# EAGLE design CHR_ver1 (EAGLE 9.6.2)

## Sheet 1 of 3
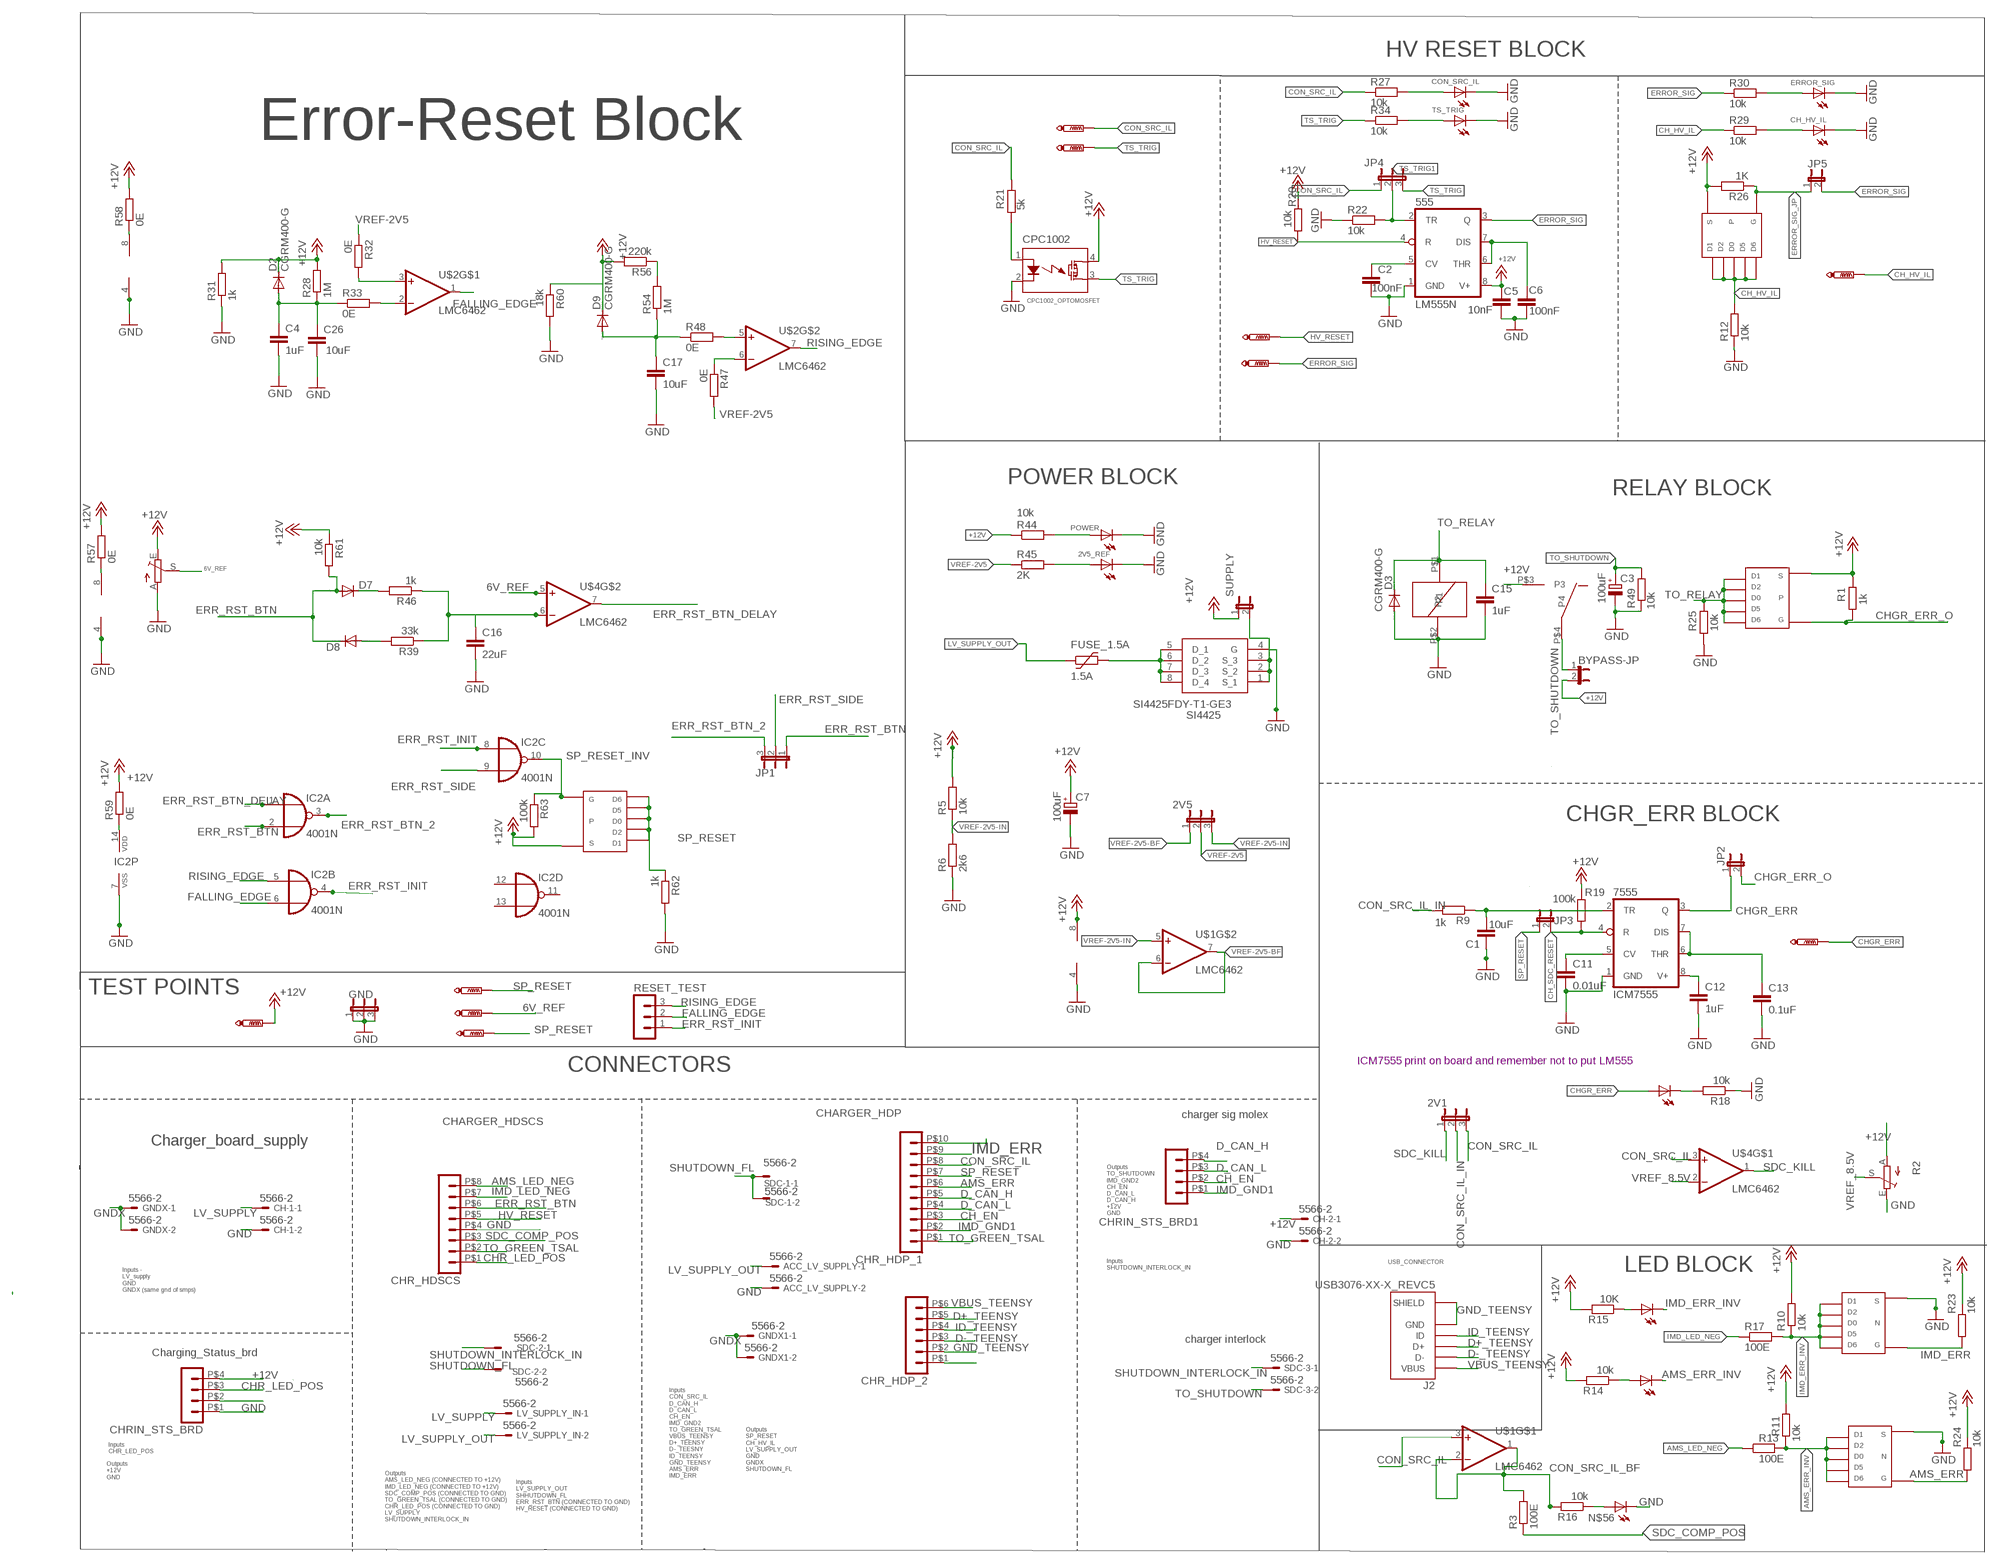
[diagram p0: schematic, sheet 1]

### Parts
2V1  JP2E  [JP2]
2V5  JP2E  [JP2]
2V5_REF  LED-FKIT-1206  [FKIT-LED-1206]
555  LM555N  [DIL08]
7555  ICM7555  LM555N  [DIL08]
+12V  PTR1PAD1-13  [P1-13]
ACC_LV_SUPPLY  5566-2  [5566-2]
AMS  LED-FKIT-1206  [FKIT-LED-1206]
AMS1  LED-FKIT-1206  [FKIT-LED-1206]
BYPASS-JP  JP1E  [JP1]
C1  10uF  C-EUC0805  [C0805]
C2  100nF  C-EUC0805  [C0805]
C3  100uF  CPOL-EUE2.5-6  [E2,5-6]
C4  1uF  C-EUC0805  [C0805]
C5  10nF  C-EUC0805  [C0805]
C6  100nF  C-EUC0805  [C0805]
C7  100uF  CPOL-EUE2.5-6  [E2,5-6]
C11  0.01uF  C-EUC0805  [C0805]
C12  1uF  C-EUC0805  [C0805]
C13  0.1uF  C-EUC0805  [C0805]
C15  1uF  C-EUC0805  [C0805]
C16  22uF  C-EUC0805  [C0805]
C17  10uF  C-EUC0805  [C0805]
C26  10uF  C-EUC0805  [C0805]
CH-1  5566-2  [5566-2]
CH-2  5566-2  [5566-2]
CH-HV-IL  PTR1PAD1-13  [P1-13]
CH_HV_IL  LED-FKIT-1206  [FKIT-LED-1206]
CHGR-ERR  PTR1PAD1-13  [P1-13]
CHGR_ERR  LED-FKIT-1206  [FKIT-LED-1206]
CHR_HDP_1  HEADER_POS10_44914-1001  [44914-1001]
CHR_HDP_2  HEADER_POS6_44914-0601  [44914-0601]
CHR_HDSCS  HEADER_POS8_44914-0801  [44914-0801]
CHRIN_STS_BRD  HEADER_POS4_44914-0401  [44914-0401]
CHRIN_STS_BRD1  HEADER_POS4_44914-0401  [44914-0401]
CON-SRC-IL  PTR1PAD1-13  [P1-13]
CON_SRC_IL  LED-FKIT-1206  [FKIT-LED-1206]
CPC1002  CPC1002_OPTOMOSFET  [SOP04]
D2  CGRM400-G  [SOD-123_MINI-SMA]
D3  CGRM400-G  [SOD-123_MINI-SMA]
D7  DIODE-DO214AC  [DO214AC]
D8  DIODE-DO214AC  [DO214AC]
D9  CGRM400-G  [SOD-123_MINI-SMA]
ERROR-SIG  PTR1PAD1-13  [P1-13]
ERROR_SIG  LED-FKIT-1206  [FKIT-LED-1206]
FUSE_1.5A  1.5A  1206L  [1206L]
GND  JP2E  [JP2]
GNDX  5566-2  [5566-2]
GNDX1  5566-2  [5566-2]
HV-RESET  PTR1PAD1-13  [P1-13]
IC2  4001N  [DIL14]
IMD  LED-FKIT-1206  [FKIT-LED-1206]
J2  USB3076-XX-X_REVC5  [GCT_USB3076-XX-X_REVC5]
JP1  JP2E  [JP2]
JP2  JP1E  [JP1]
JP3  JP1E  [JP1]
JP4  JP2E  [JP2]
JP5  JP1E  [JP1]
LV_SUPPLY_IN  5566-2  [5566-2]
POWER  LED-FKIT-1206  [FKIT-LED-1206]
R1  1k  R-EU_R0805  [R0805]
R2  TRIM_EU-S63S  [S63S]
R3  100E  R-EU_M0805  [M0805]
R5  10k  R-EU_R0805  [R0805]
R6  2k6  R-EU_R0805  [R0805]
R9  1k  R-EU_R0805  [R0805]
R10  10k  R-EU_R0805  [R0805]
R11  10k  R-EU_R0805  [R0805]
R12  10k  R-EU_R0805  [R0805]
R13  100E  R-EU_M0805  [M0805]
R14  10k  R-EU_M0805  [M0805]
R15  10K  R-EU_M0805  [M0805]
R16  10k  R-EU_M0805  [M0805]
R17  100E  R-EU_M0805  [M0805]
R18  10k  R-EU_R0805  [R0805]
R19  100k  R-EU_R0805  [R0805]
R20  10k  R-EU_R0805  [R0805]
R21  5k  R-EU_R0805  [R0805]
R22  10k  R-EU_R0805  [R0805]
R23  10k  R-EU_R0805  [R0805]
R24  10k  R-EU_R0805  [R0805]
R25  10k  R-EU_R0805  [R0805]
R26  1K  R-EU_R0805  [R0805]
R27  10k  R-EU_R0805  [R0805]
R28  1M  R-EU_R0805  [R0805]
R29  10k  R-EU_R0805  [R0805]
R30  10k  R-EU_R0805  [R0805]
R31  1k  R-EU_R0805  [R0805]
R32  0E  R-EU_R0805  [R0805]
R33  0E  R-EU_R0805  [R0805]
R34  10k  R-EU_R0805  [R0805]
R39  33k  R-EU_R0805  [R0805]
R44  10k  R-EU_R0805  [R0805]
R45  2K  R-EU_R0805  [R0805]
R46  1k  R-EU_R0805  [R0805]
R47  0E  R-EU_R0805  [R0805]
R48  0E  R-EU_R0805  [R0805]
R49  10k  R-EU_R0805  [R0805]
R54  1M  R-EU_R0805  [R0805]
R56  220k  R-EU_R0805  [R0805]
R57  0E  R-EU_R0805  [R0805]
R58  0E  R-EU_R0805  [R0805]
R59  0E  R-EU_R0805  [R0805]
R60  18k  R-EU_R0805  [R0805]
R61  10k  R-EU_R0805  [R0805]
R62  1k  R-EU_R0805  [R0805]
R63  100k  R-EU_R0805  [R0805]
REF_POT1  10k  TRIM_EU-S63S  [S63S]
RESET_TEST  MA03-1  [MA03-1]
SDC-1  5566-2  [5566-2]
SDC-2  5566-2  [5566-2]
SDC-3  5566-2  [5566-2]
SI4425  SI4425FDY-T1-GE3  [SOIC127P600X175-8N]
SP_RESET  PTR1PAD1-13  [P1-13]
SP_RESET1  PTR1PAD1-13  [P1-13]
SP_RESET2  PTR1PAD1-13  [P1-13]
SUPPLY  JP1E  [JP1]
TS-TRIG  PTR1PAD1-13  [P1-13]
TS_TRIG  LED-FKIT-1206  [FKIT-LED-1206]
U$1  LMC6462  [S08]
U$2  LMC6462  [S08]
U$3  TSOP-6_PMOS  [TSOP-6_PMOS]
U$4  LMC6462  [S08]
U$5  TSOP-6_NMOS  [TSOP-6_NMOS]
U$7  TSOP-6_NMOS  [TSOP-6_NMOS]
U$8  TSOP-6_PMOS  [TSOP-6_PMOS]
U$9  G6DN_RELAY  [G6DN_RELAY]
U$11  TSOP-6_PMOS  [TSOP-6_PMOS]

### Nets
6V_REF: REF_POT1.S SP_RESET1.TP U$4.5(+IN)
+12V: 555.8(V+) 7555.8(V+) +12V.TP BYPASS-JP.2 C5.1 C7.+ C12.1 CH-2.1 CHRIN_STS_BRD.P$4 CPC1002.4 D2.C D9.C R1.2 R2.A R5.2 R10.2 R11.2 R14.2 R15.2 R19.1 R20.2 R23.2 R24.2 R26.2 R28.2 R31.2 R44.1 R56.2 R57.2 R58.2 R59.2 R60.1 R61.1 R63.2 REF_POT1.E SUPPLY.1 U$1.8(V+) U$3.S U$8.S U$9.P$3(P3) U$11.S
AMS_ERR: CHR_HDP_1.P$6 R24.1 U$5.G
AMS_ERR_INV: AMS.C R11.1 R13.2 U$5.1 U$5.2 U$5.5 U$5.6 U$5.D(D0)
AMS_LED_NEG: CHR_HDSCS.P$8 R13.1
CH_EN: CHR_HDP_1.P$3 CHRIN_STS_BRD1.P$2
CH_HV_IL: CH-HV-IL.TP CHR_HDP_1.P$10 R12.2 R29.1 U$8.1 U$8.2 U$8.5 U$8.6 U$8.D(D0)
CH_SDC_RESET: 7555.4(R) JP3.2 R19.2
CHGR_ERR: 7555.3(Q) CHGR-ERR.TP CHGR_ERR.A JP2.1
CHGR_ERR_O: JP2.2 R1.1 U$3.G
CHR_LED_POS: CHR_HDSCS.P$1 CHRIN_STS_BRD.P$3
CON_SRC_IL: 2V1.3 CHR_HDP_1.P$8 CON-SRC-IL.TP JP4.1 R21.2 R27.1 U$1.3(+IN) U$4.3(+IN)
CON_SRC_IL_BF: R3.2 R16.2 U$1.1(OUT) U$1.2(-IN)
CON_SRC_IL_IN: 2V1.2 R9.2
D+_TEENSY: CHR_HDP_2.P$5 J2.3(D+)
D-_TEENSY: CHR_HDP_2.P$3 J2.2(D-)
D_CAN_H: CHR_HDP_1.P$5 CHRIN_STS_BRD1.P$4
D_CAN_L: CHR_HDP_1.P$4 CHRIN_STS_BRD1.P$3
ERR_RST_BTN: CHR_HDSCS.P$6 D7.A D8.C IC2.2(A:I1) JP1.1 R61.2
ERR_RST_BTN_2: IC2.3(A:O) JP1.3
ERR_RST_BTN_DELAY: IC2.1(A:I0) U$4.7(OUT)
ERR_RST_INIT: IC2.4(B:O) IC2.8(C:I0) RESET_TEST.1
ERR_RST_SIDE: IC2.9(C:I1) JP1.2
ERROR_SIG: 555.3(Q) ERROR-SIG.TP JP5.2 R30.1
ERROR_SIG_JP: JP5.1 R26.1 U$8.G
FALLING_EDGE: IC2.6(B:I1) RESET_TEST.2 U$2.1(OUT)
GND: 2V5_REF.C 555.1(GND) 7555.1(GND) ACC_LV_SUPPLY.2 AMS1.C C1.1 C2.2 C3.- C4.2 C5.2 C6.2 C7.- C11.2 C12.2 C13.2 C15.2 C16.2 C17.2 C26.2 CH-1.2 CH-2.2 CH_HV_IL.C CHR_HDSCS.P$4 CHRIN_STS_BRD.P$1 CON_SRC_IL.C CPC1002.2 D3.A ERROR_SIG.C GND.1 GND.2 GND.3 IC2.7(P:VSS) POWER.C R2.E R6.1 R12.1 R18.1 R22.1 R25.1 R31.1 R49.1 R60.2 R62.2 REF_POT1.A SI4425.4(G) TS_TRIG.C U$1.4(V-) U$2.4(V-) U$4.4(V-) U$5.S U$7.S U$9.P$2(P2)
GND_TEENSY: CHR_HDP_2.P$2 J2.5(GND) J2.6(SHIELD) J2.7(SHIELD) J2.8(SHIELD) J2.9(SHIELD) J2.10(SHIELD) J2.11(SHIELD)
GNDX: GNDX1.1 GNDX1.2 GNDX.1 GNDX.2
HV_RESET: 555.4(R) CHR_HDSCS.P$5 HV-RESET.TP R20.1
ID_TEENSY: CHR_HDP_2.P$4 J2.4(ID)
IMD_ERR: CHR_HDP_1.P$9 R23.1 U$7.G
IMD_ERR_INV: IMD.C R10.1 R17.2 U$7.1 U$7.2 U$7.5 U$7.6 U$7.D(D0)
IMD_GND1: CHR_HDP_1.P$2 CHRIN_STS_BRD1.P$1
IMD_LED_NEG: CHR_HDSCS.P$7 R17.1
LV_SUPPLY: CH-1.1 LV_SUPPLY_IN.1
LV_SUPPLY_OUT: ACC_LV_SUPPLY.1 FUSE_1.5A.P$1 LV_SUPPLY_IN.2
N$1: 7555.2(TR) C1.2 R9.1
N$3: 555.5(CV) C2.1
N$4: CHGR_ERR.C R18.2
N$7: 555.6(THR) 555.7(DIS) C6.1
N$9: CPC1002.1 R21.1
N$10: CON_SRC_IL.A R27.2
N$11: CH_HV_IL.A R29.2
N$13: ERROR_SIG.A R30.2
N$14: R34.2 TS_TRIG.A
N$16: 7555.5(CV) C11.1
N$18: 7555.6(THR) 7555.7(DIS) C13.1
N$21: SI4425.1(S_1) SI4425.2(S_2) SI4425.3(S_3) SUPPLY.2
N$23: FUSE_1.5A.P$2 SI4425.5(D_1) SI4425.6(D_2) SI4425.7(D_3) SI4425.8(D_4)
N$24: POWER.A R44.2
N$26: 2V5_REF.A R45.2
N$33: CHR_HDP_2.P$1
N$35: AMS.A R14.1
N$37: IMD.A R15.1
N$38: C4.1 C26.1 D2.A R28.1 R33.1
N$39: CHRIN_STS_BRD.P$2
N$40: R32.2 U$2.3(+IN)
N$41: R33.2 U$2.2(-IN)
N$42: D8.A R39.2
N$43: D7.C R46.2
N$44: C16.1 R39.1 R46.1 U$4.6(-IN)
N$45: R47.1 U$2.6(-IN)
N$46: C17.1 D9.A R48.1 R54.1
N$47: R48.2 U$2.5(+IN)
N$48: R54.2 R56.1
N$49: R58.1 U$2.8(V+)
N$50: R57.1 U$4.8(V+)
N$51: IC2.14(P:VDD) R59.1
N$56: AMS1.A R16.1
RISING_EDGE: IC2.5(B:I0) RESET_TEST.3 U$2.7(OUT)
SDC_COMP_POS: CHR_HDSCS.P$3 R3.1
SDC_KILL: 2V1.1 U$4.1(OUT)
SHUTDOWN_FL: SDC-1.1 SDC-1.2 SDC-2.2
SHUTDOWN_INTERLOCK_IN: SDC-2.1 SDC-3.1
SP_RESET: CHR_HDP_1.P$7 JP3.1 R62.1 SP_RESET2.TP SP_RESET.TP U$11.1 U$11.2 U$11.5 U$11.6 U$11.D(D0)
SP_RESET_INV: IC2.10(C:O) R63.1 U$11.G
TO_GREEN_TSAL: CHR_HDP_1.P$1 CHR_HDSCS.P$2
TO_RELAY: C15.1 D3.C R25.2 U$3.1 U$3.2 U$3.5 U$3.6 U$3.D(D0) U$9.P$1(P1)
TO_SHUTDOWN: BYPASS-JP.1 C3.+ R49.2 SDC-3.2 U$9.P$4(P4)
TS_TRIG: CPC1002.3 JP4.3 R34.1 TS-TRIG.TP
TS_TRIG1: 555.2(TR) JP4.2 R22.2
VBUS_TEENSY: CHR_HDP_2.P$6 J2.1(VBUS)
VREF-2V5: 2V5.2 R32.1 R45.1 R47.2
VREF-2V5-BF: 2V5.1 U$1.6(-IN) U$1.7(OUT)
VREF-2V5-IN: 2V5.3 R5.1 R6.2 U$1.5(+IN)
VREF_8.5V: R2.S U$4.2(-IN)
Unconnected: IC2.11(D:O) IC2.12(D:I0) IC2.13(D:I1)

### Notes on the sheet
- HV RESET BLOCK
- Error-Reset Block
- POWER BLOCK
- RELAY BLOCK
- CHGR_ERR BLOCK
- TEST POINTS
- ICM7555 print on board and remember not to put LM555
- CONNECTORS
- CHARGER_HDP | charger sig molex
- CHARGER_HDSCS
- Charger_board_supply
- Outputs
  TO_SHUTDOWN
  IMD_GND2
  CH_EN
  D_CAN_L
  D_CAN_H
  +12V
  GND
- USB_CONNECTOR
- Inputs
  SHUTDOWN_INTERLOCK_IN
- LED BLOCK
- Inputs -
  LV_supply
  GND
  GNDX (same gnd of smps)
- charger interlock
- Charging_Status_brd
- Inputs
  CHR_LED_POS
- Inputs
  CON_SRC_IL
  D_CAN_H
  D_CAN_L
  CH_EN
  IMD_GND2
  TO_GREEN_TSAL
  VBUS_TEENSY
  D+_TEENSY
  D-_TEESNY
  ID_TEENSY
  GND_TEENSY
  AMS_ERR
  IMD_ERR
- Outputs
  SP_RESET
  CH_HV_IL
  LV_SUPPLY_OUT
  GND
  GNDX
  SHUTDOWN_FL
- Outputs
  +12V
  GND
- Inputs
  LV_SUPPLY_OUT
  SHHUTDOWN_FL
  ERR_RST_BTN (CONNECTED TO GND)
  HV_RESET (CONNECTED TO GND)
- Outputs
  AMS_LED_NEG (CONNECTED TO +12V)
  IMD_LED_NEG (CONNECTED TO +12V)
  SDC_COMP_POS (CONNECTED TO GND)
  TO_GREEN_TSAL (CONNECTED TO GND)
  CHR_LED_POS (CONNECTED TO GND)
  LV_SUPPLY
  SHUTDOWN_INTERLOCK_IN

## Sheet 2 of 3

## Sheet 3 of 3

## Library data of the parts
2V1 2V5 GND JP1 JP4 = jumper:JP2E: JUMPER
2V5_REF AMS AMS1 CH_HV_IL CHGR_ERR CON_SRC_IL ERROR_SIG IMD POWER TS_TRIG = IIT_BOMBAY_Racing:LED: LEDs Standard schematic elements and footprints for 5mm, 3mm, 1206, and 0603 sized LEDs. 5mm - Spark Fun Electronics SKU : COM-00529 (and others)
555 7555 = linear:*555: TIMER
+12V CH-HV-IL CHGR-ERR CON-SRC-IL ERROR-SIG HV-RESET SP_RESET SP_RESET1 SP_RESET2 TS-TRIG = testpad:PTR1: TEST PIN
ACC_LV_SUPPLY CH-1 CH-2 GNDX GNDX1 LV_SUPPLY_IN SDC-1-SDC-3 = con-molex:5566-2: Mini FIT connector 2 pol Source: http://www.molex.com; MF: MOLEX; OC_FARNELL: 1822072; OC_NEWARK: unknown
BYPASS-JP JP2 JP3 JP5 SUPPLY = jumper:JP1E: JUMPER
C1 C2 C4-C6 C11-C13 C15-C17 C26 = IIT_BOMBAY_Racing:C-EU: CAPACITOR, European symbol
C3 C7 = IIT_BOMBAY_Racing:CPOL-EU: POLARIZED CAPACITOR, European symbol
CHR_HDP_1 = IIT_BOMBAY_Racing:HEADER_POS10_?: Molex - Micro-Fit 3.0 Series connector, 3.00mm (0.118") pitch header, 10 positions.
CHR_HDP_2 = IIT_BOMBAY_Racing:HEADER_POS6_?: Molex - Micro-Fit 3.0 Series connector, 3.00mm (0.118") pitch header, 6 positions.
CHR_HDSCS = IIT_BOMBAY_Racing:HEADER_POS8_?: Molex - Micro-Fit 3.0 Series connector, 3.00mm (0.118") pitch header, 8 positions.
CHRIN_STS_BRD CHRIN_STS_BRD1 = IIT_BOMBAY_Racing:HEADER_POS4_?: Molex - Micro-Fit 3.0 Series connector, 3.00mm (0.118") pitch header, 4 positions.
CPC1002 = IIT_BOMBAY_Racing:CPC1002_OPTOMOSFET: optomosfet for the precharge brd(hv indicator)
D2 D3 D9 = IIT_BOMBAY_Racing:CGRM400*-G: Molded plasitc,JEDEC SOD-123/Mini SMA Source: Comchip CGRM4001-G.pdf
D7 D8 = IIT_BOMBAY_Racing2:DIODE-: DIODE
FUSE_1.5A = fuse_1206L:1206L; MFR: Littelfuse; MFR_ID: 1206L175SLYR; PRODUCT_ID: 576-1206L175SLYR
IC2 = 40xx:4001: Quad 2-input NOR
J2 = USB3076-XX-X_REVC5:USB3076-XX-X_REVC5: Check availability <https://pricing.snapeda.com/parts/USB3076-30-A/Global%20Connector%20Technology/view-part?ref=eda>; AVAILABILITY: Not in stock; CHECK_PRICES: https://www.snapeda.com/parts/USB3076-30-A/Global+Connector+Technology/view-part/?ref=eda; DESCRIPTION: USB - micro B USB 2.0 Receptacle Connector 5 Position Surface Mount, Right Angle; Through Hole, 2.35mm profile, 5 Pins, Horizontal, Bottom mount; MF: Global Connector Technology; MP: USB3076-30-A; PACKAGE: None; PRICE: None; SNAPEDA_LINK: https://www.snapeda.com/parts/USB3076-30-A/Global+Connector+Technology/view-part/?ref=snap
R1 R5 R6 R9-R12 R18-R34 R39 R44-R49 R54 R56-R63 = IIT_BOMBAY_Racing:R-EU_: RESISTOR, European symbol
R2 REF_POT1 = IIT_BOMBAY_Racing:TRIM_EU-: POTENTIOMETER
R3 R13-R17 = rcl:R-EU_: RESISTOR, European symbol; SPICEPREFIX: R
RESET_TEST = con-lstb:MA03-1: PIN HEADER; OC_FARNELL: unknown; OC_NEWARK: unknown
SI4425 = SamacSys_Parts:SI4425FDY-T1-GE3: MOSFET P-CHANNEL 30-V (D-S) MOSFET Source: Datasheet <https://www.vishay.com/docs/77095/si4425fdy.pdf>; DESCRIPTION: MOSFET P-CHANNEL 30-V (D-S) MOSFET; HEIGHT: 1.75mm; MANUFACTURER_NAME: Vishay; MANUFACTURER_PART_NUMBER: SI4425FDY-T1-GE3; MOUSER_PART_NUMBER: 78-SI4425FDY-T1-GE3; MOUSER_PRICE-STOCK: https://www.mouser.co.uk/ProductDetail/Vishay-Siliconix/SI4425FDY-T1-GE3?qs=%252B6g0mu59x7IUQKSn86z1oQ%3D%3D
U$1 U$2 U$4 = IIT_BOMBAY_Racing:LMC6462
U$3 U$11 = TSOP-6_MOS:TSOP-6_PMOS
U$5 U$7 = TSOP-6_MOS:TSOP-6_NMOS
U$8 = ACU-MOSFET-updated:TSOP-6_PMOS
U$9 = G6DN_Omron:G6DN_RELAY

## Board
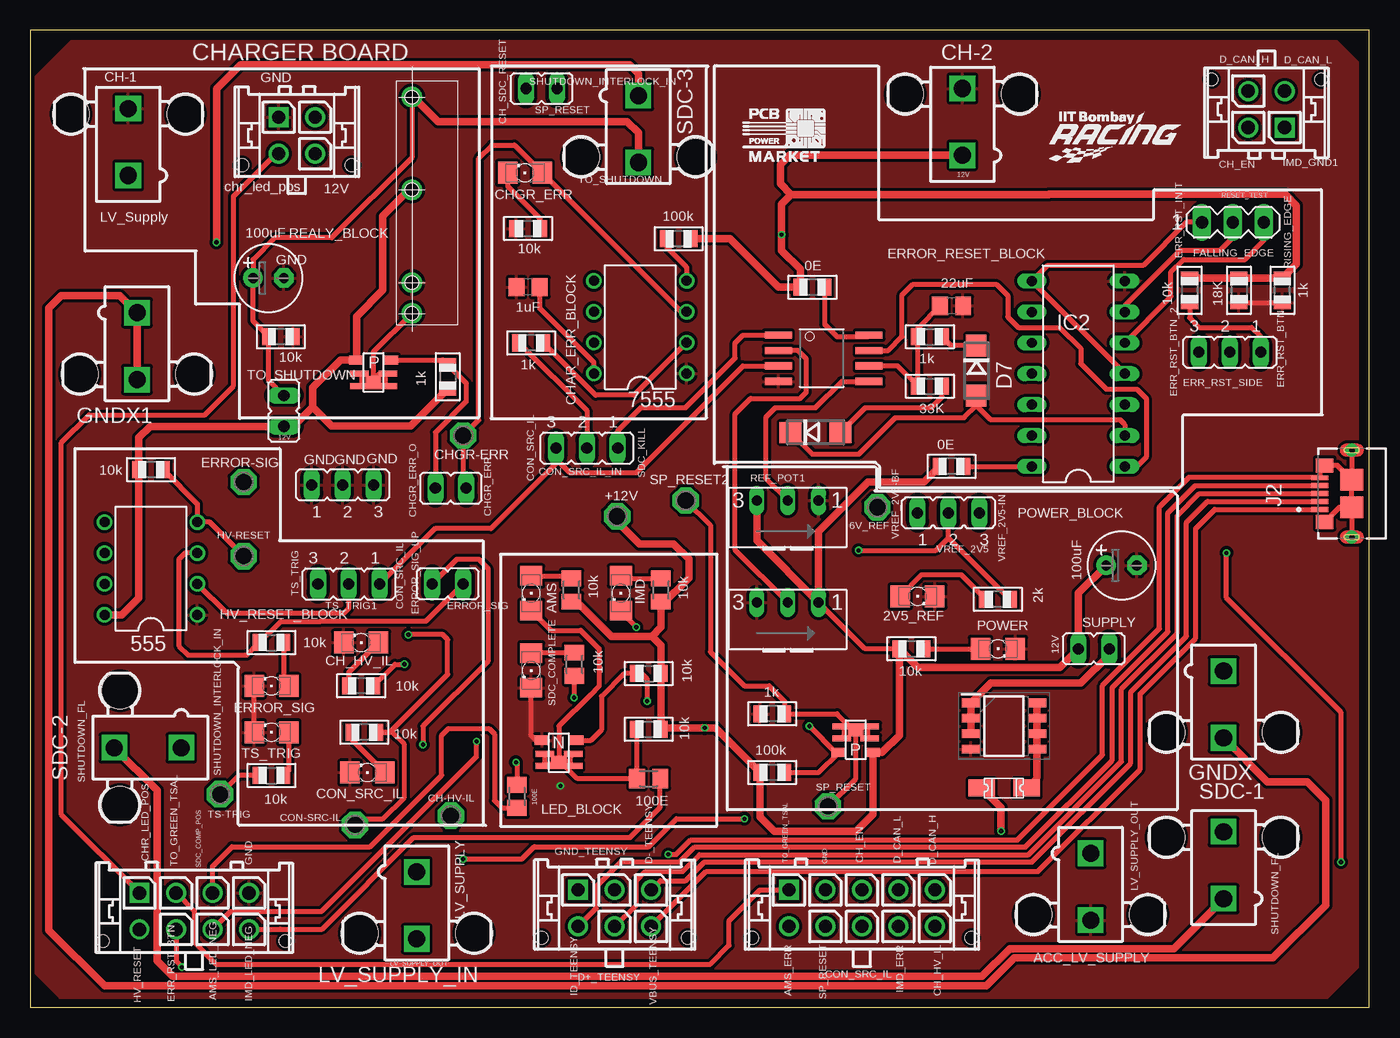
[diagram p1: board, top side]
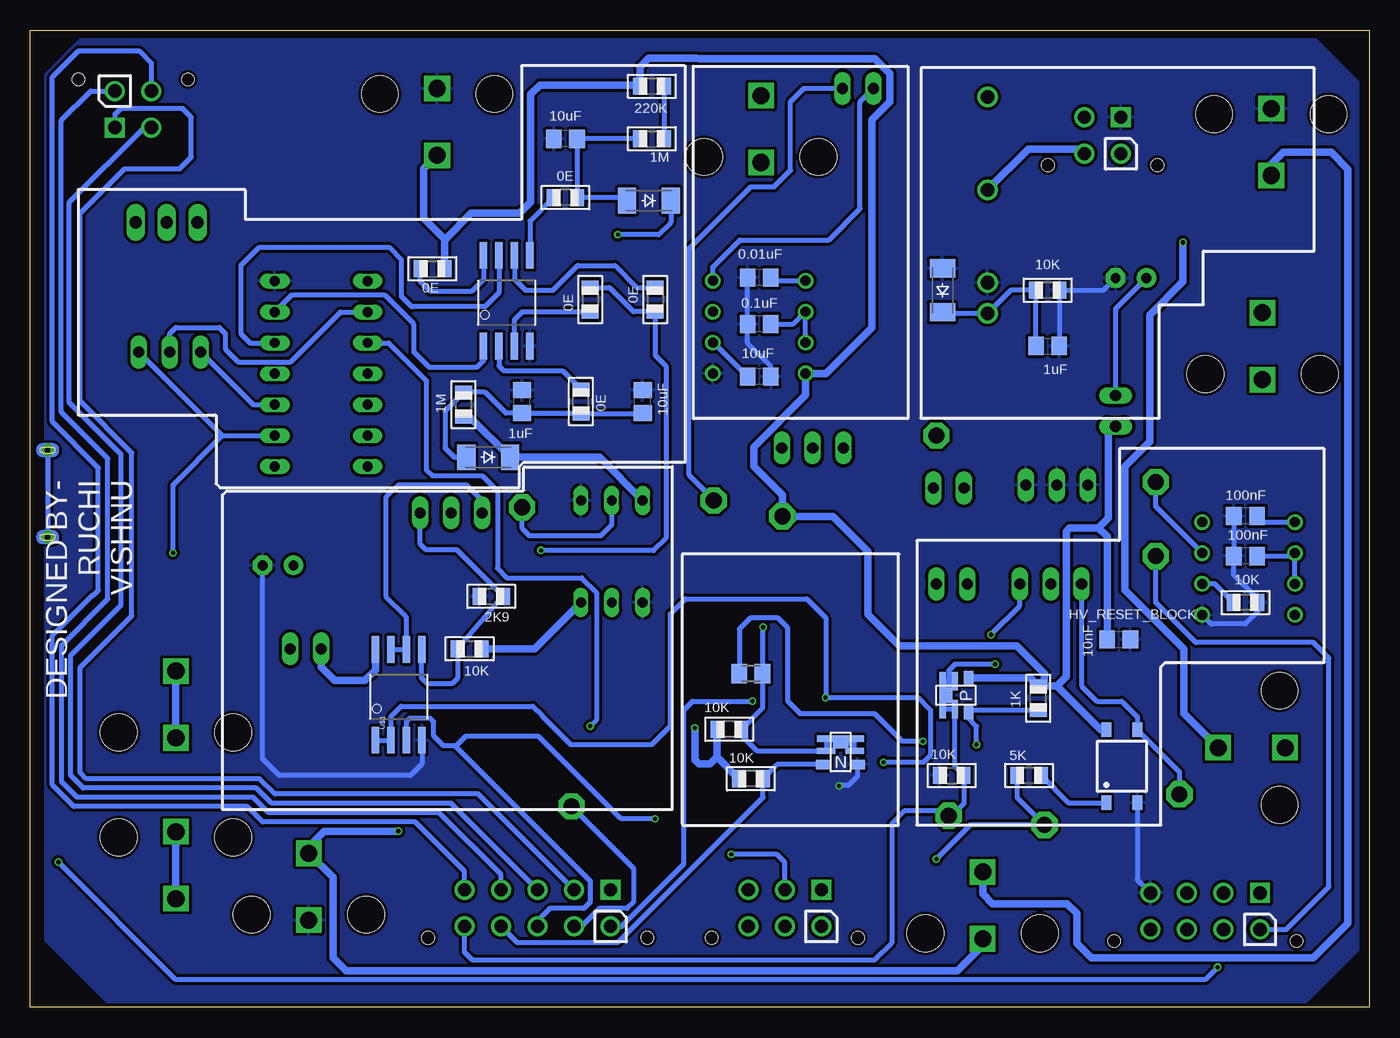
[diagram p2: board, bottom side, seen from below]

Size 110 x 80.29 mm. Coordinates in mm from the lower left corner, seen from the top.
Outline: 0,0 110,0 110,80.29 0,80.29 0,0
Copper layers (1*16): Top 0.035mm / dielectric 1.5mm / Bottom 0.035mm
Design rules "PCB_Power": minimum track width 5mil, minimum drill 10mil, track to track 5mil, track to pad 5mil, pad to pad 5mil, via to via 5mil, smd to smd 5mil, copper to edge 10mil, drill to drill 6mil, minimum pad ring 5mil, minimum via ring 5mil, stop-mask expansion 3mil, vias tented up to drill 0mil, thermal gap 10mil

### Footprints (pad centres in the part's own frame; a part is rotated, then mirrored left to right if it is on the bottom)
JP2 = drill 0.914 long: 1 -2.54,0; 2 0,0; 3 2.54,0
FKIT-LED-1206 = smd 1.6 x 1.803: A -1.422,0; C 1.422,0
DIL08 = drill 0.813 pad 1.27: 1 -3.81,-3.81; 2 -1.27,-3.81; 3 1.27,-3.81; 4 3.81,-3.81; 5 3.81,3.81; 6 1.27,3.81; 7 -1.27,3.81; 8 -3.81,3.81
P1-13 = drill 1.321 pad 2.159 octagon: TP 0,0
5566-2 = drill 1.4 square: 1 0,-2.75; 2 0,2.75 | hole 3: 4.7,2.29; -4.7,2.29
JP1 = drill 0.914 long: 1 0,-1.27; 2 0,1.27
C0805 = smd 1.3 x 1.5: 1 -0.95,0; 2 0.95,0
E2,5-6 = drill 0.813 pad 1.6: + -1.27,0 | drill 0.813 pad 1.6 octagon: - 1.27,0
44914-1001 = drill 1.09 square: P$1 6,0 | drill 1.09: P$2 3,0; P$3 0,0; P$4 -3,0; P$5 -6,0; P$6 6,3; P$7 3,3; P$8 0,3; P$9 -3,3; P$10 -6,3 | hole 1.02: 9,3.94; -9,3.94
44914-0601 = drill 1.09 square: P$1 3,0 | drill 1.09: P$2 0,0; P$3 -3,0; P$4 3,3; P$5 0,3; P$6 -3,3 | hole 1.02: 6,3.94; -6,3.94
44914-0801 = drill 1.09 square: P$1 4.5,0 | drill 1.09: P$2 1.5,0; P$3 -1.5,0; P$4 -4.5,0; P$5 4.5,3; P$6 1.5,3; P$7 -1.5,3; P$8 -4.5,3 | hole 1.02: 7.5,3.94; -7.5,3.94
44914-0401 = drill 1.09 square: P$1 1.5,0 | drill 1.09: P$2 -1.5,0; P$3 1.5,3; P$4 -1.5,3 | hole 1.02: 4.5,3.94; -4.5,3.94
SOP04 = smd 0.8 x 1.2: 1 -1.27,-3; 2 1.27,-3; 3 1.27,3; 4 -1.27,3
SOD-123_MINI-SMA = smd 1.5 x 2.1: A 1.8,0; C -1.8,0
DO214AC = smd 1.8 x 1.7: A 2.05,0; C -2.05,0
1206L = smd 2.16 x 1.4: P$1 -1.85,0; P$2 1.85,0
DIL14 = drill 0.813 long: 1 -7.62,-3.81; 2 -5.08,-3.81; 3 -2.54,-3.81; 4 0,-3.81; 5 2.54,-3.81; 6 5.08,-3.81; 7 7.62,-3.81; 8 7.62,3.81; 9 5.08,3.81; 10 2.54,3.81; 11 0,3.81; 12 -2.54,3.81; 13 -5.08,3.81; 14 -7.62,3.81
GCT_USB3076-XX-X_REVC5 = smd 0.4 x 1.4: 1 -1.3,2.65; 2 -0.65,2.65; 3 0,2.65; 4 0.65,2.65; 5 1.3,2.65 | drill 0.45 pad 1.05: 6 -3.575,0; 7 3.575,0 | smd 1.15 x 1.45: 8 -2.32,2.23; 9 2.32,2.23 | smd 1.75 x 1.9: 10 -1.125,0; 11 1.125,0
R0805 = smd 1.1 x 1.4: 1 -1,0; 2 1,0
S63S = drill 0.813 long: A 2.54,1.27; E -2.54,1.27; S 0,1.27
M0805 = smd 1.3 x 1.6: 1 -0.95,0; 2 0.95,0
MA03-1 = drill 1.016 long: 1 -2.54,0; 2 0,0; 3 2.54,0
SOIC127P600X175-8N = smd 1.525 x 0.7: 1 -2.712,1.905; 2 -2.712,0.635; 3 -2.712,-0.635; 4 -2.712,-1.905; 5 2.712,-1.905; 6 2.712,-0.635; 7 2.712,0.635; 8 2.712,1.905
S08 = smd 0.61 x 2.21: 1 -1.905,-3.569; 2 -0.635,-3.569; 3 0.635,-3.569; 4 1.905,-3.569; 5 1.905,3.886; 6 0.635,3.886; 7 -0.635,3.886; 8 -1.905,3.886
TSOP-6_PMOS = smd 0.5 x 1.92: 1 -1,-0.96; 6 -1,0.96 | smd 0.5 x 1.52: 2 0,-1.16; 5 0,1.16 | smd 0.635 x 1.27: D -0.5,0 | smd 0.75 x 1.2: G 1.13,-1.4; S 1.13,1.4
TSOP-6_NMOS = smd 0.5 x 1.92: 1 -1,-0.96; 6 -1,0.96 | smd 0.5 x 1.52: 2 0,-1.16; 5 0,1.16 | smd 0.635 x 1.27: D -0.5,0 | smd 0.75 x 1.2: G 1.13,-1.4; S 1.13,1.4
G6DN_RELAY = drill 1.118 pad 1.575: P$1 0.889,3.708; P$2 3.429,3.708; P$3 11.049,3.708; P$4 18.669,3.708

### Placement (x,y rotation side)
2V1  45.72,45.97 180 top
2V5  75.44,40.64 0 top
2V5_REF  72.9,33.78 0 top
555  9.91,36.07 90 top
7555  50.11,55.9 90 top
+12V  48.21,40.36 0 top
ACC_LV_SUPPLY  87.12,9.91 180 top
AMS  41.15,34.04 270 top
AMS1  41.15,27.69 270 top
BYPASS-JP  20.83,49.02 180 top
C1  50.11,51.84 180 bottom
C2  10.16,40.39 180 bottom
C3  19.56,59.94 0 top
C4  69.6,49.78 90 bottom
C5  20.57,30.23 0 bottom
C6  10.16,37.08 180 bottom
C7  89.66,36.32 0 top
C11  50.11,59.96 180 bottom
C12  40.89,59.18 180 top
C13  50.11,56.15 180 bottom
C15  26.42,54.36 0 bottom
C16  75.69,57.66 0 top
C17  66.04,71.37 180 bottom
C26  59.69,49.78 90 bottom
CH-1  8.04,71.12 0 top
CH-2  76.58,72.77 0 top
CH-HV-IL  34.54,15.75 0 top
CH_HV_IL  27.18,29.97 180 top
CHGR-ERR  35.56,46.99 0 top
CHGR_ERR  40.64,68.58 180 top
CHR_HDP_1  68.33,9.65 180 top
CHR_HDP_2  48.01,9.65 180 top
CHR_HDSCS  13.46,9.4 180 top
CHRIN_STS_BRD  21.9,73.15 180 top
CHRIN_STS_BRD1  101.56,72.3 0 top
CON-SRC-IL  26.67,14.99 0 top
CON_SRC_IL  27.69,19.3 180 top
CPC1002  20.32,19.81 0 bottom
D2  72.39,45.21 180 bottom
D3  35.05,58.93 90 bottom
D7  77.72,52.32 270 top
D8  64.52,47.24 0 top
D9  59.18,66.29 180 bottom
ERROR-SIG  17.53,43.18 0 top
ERROR_SIG  19.81,26.42 180 top
FUSE_1.5A  80.01,18.03 0 top
GND  25.65,42.93 0 top
GNDX  98.04,24.89 180 top
GNDX1  8.76,54.33 180 top
HV-RESET  17.53,37.08 0 top
IC2  86.11,52.07 90 top
IMD  48.51,34.04 270 top
J2  108.58,42.22 90 top
JP1  98.55,53.85 180 top
JP2  34.54,42.67 90 top
JP3  41.99,75.52 90 top
JP4  26.16,34.8 180 top
JP5  34.29,34.8 270 top
LV_SUPPLY_IN  31.75,8.38 180 top
POWER  79.5,29.46 0 top
R1  34.29,51.82 270 top
R2  62.23,32 0 top
R3  39.98,17.34 90 top
R5  73.91,29.46 0 bottom
R6  72.14,33.78 0 bottom
R9  41.15,54.61 180 top
R10  52.58,22.86 180 bottom
R11  50.8,22.86 0 top
R12  34.29,19.05 0 bottom
R13  50.8,18.8 180 top
R14  44.45,34.29 270 top
R15  51.82,34.29 270 top
R16  44.7,28.19 270 top
R17  50.8,27.43 0 bottom
R18  40.89,64.01 0 top
R19  53.27,63.16 180 top
R20  9.91,44.2 180 top
R21  27.94,19.05 180 bottom
R22  10.16,33.27 180 bottom
R23  50.8,18.8 180 bottom
R24  50.8,27.43 0 top
R25  26.42,58.93 180 bottom
R26  27.18,25.4 90 bottom
R27  27.43,22.61 180 top
R28  74.42,49.53 270 bottom
R29  27.18,26.42 180 top
R30  19.81,29.97 0 top
R31  102.87,58.93 90 top
R32  64.01,58.17 270 bottom
R33  64.77,49.78 90 bottom
R34  19.81,19.05 0 top
R39  73.91,51.05 0 top
R44  72.39,29.46 0 top
R45  79.5,33.53 180 top
R46  73.91,55.12 0 top
R47  58.67,58.17 270 bottom
R48  66.04,66.55 180 bottom
R49  20.57,55.12 180 top
R54  58.93,71.37 0 bottom
R56  58.93,75.69 180 bottom
R57  64.26,59.18 180 top
R58  76.96,60.71 0 bottom
R59  75.69,44.45 180 top
R60  99.31,58.93 270 top
R61  95.25,58.93 270 top
R62  60.96,24.13 180 top
R63  60.96,19.3 180 top
REF_POT1  62.23,40.39 0 top
RESET_TEST  98.81,64.52 0 top
SDC-1  98.04,11.68 0 top
SDC-2  9.65,21.34 90 top
SDC-3  49.95,72.19 180 top
SI4425  80.01,23.11 0 top
SP_RESET  65.53,16.51 0 top
SP_RESET1  69.6,41.1 0 top
SP_RESET2  53.85,41.66 0 top
SUPPLY  87.38,29.46 270 top
TS-TRIG  15.58,17.52 0 top
TS_TRIG  19.81,22.61 180 top
U$1  79.74,25.52 0 bottom
U$2  70.87,57.91 0 bottom
U$3  28.19,52.07 90 top
U$4  65.02,53.34 270 top
U$5  43.43,20.83 90 top
U$7  43.43,21.08 270 bottom
U$8  34.04,25.65 0 bottom
U$9  35.05,56.13 90 top
U$11  67.82,22.1 270 top
U$13  LOGO_PCBPOWER  [270X170]  58.49,69.49 0 top
U$15  [IITBR_LOGO]  83.68,69.36 0 top

### Tracks (layer width: path | path; a pad name or v marks a point on that pad's centre or on a via)
6V_REF
  Top 0.406: REF_POT1.S 60.45,43.43 60.45,48.51 61.21,49.28 64.52,49.28 66.67,51.44 U$4.5
  Bottom 0.406: REF_POT1.S 62.23,39.64 63.1,38.77 69.01,38.77 69.6,39.36 SP_RESET1.TP
+12V  (via drill 0.35)
  Top 0.406: R14.2 44.89,33.34 | 51.82,33.02 R15.2 | 51.05,30.48 51.06,30.49 | 7555.8 46.3,53 41.84,57.46 C12.1 | 20.86,47.78 BYPASS-JP.2 | 31.11,67.18 U$9.P$3 | U$11.S 69.99,20.97 | R44.1 68.58,29.46 R2.A | 83.69,66.8 83.69,66.83 | R11.2 51.9,22.96
  Top 0.61: 44.89,33.34 47.75,30.48 51.05,30.48 | R11.2 R24.2 51.8,29.75 51.06,30.49 51.82,31.24 51.82,33.02 54.1,35.31 54.1,36.83 52.83,38.1 50.04,38.1 48.21,39.93 +12V.TP | R61.1 R60.1 R31.2 104.04,61.09 104.04,65.89 103.1,66.83 83.69,66.83 | R1.2 31.25,47.78 24.76,47.78 23.2,49.34 | 31.11,67.18 28.96,65.02 28.96,58.93 26.79,56.77 U$3.S 25.48,53.2 23.2,50.92 23.2,49.34 | 555.8 7.5,32.26 8.91,33.66 R20.2 8.91,46.82 9.84,47.75 BYPASS-JP.2 | REF_POT1.E 59.69,38.35 R2.A 64.77,39.12 68.83,43.18 73.42,43.18 R59.2 | R19.1 57.49,63.16 61.46,59.18 R57.2 63.26,60.66 61.72,62.2 v61.72,63.5 61.72,66.02 62.51,66.8 | 69.99,20.97 71.39,22.37 R44.1 72.91,27.94 84.58,27.94 SUPPLY.1 86.11,34.04 C7.+ | 62.51,66.8 83.69,66.8 | 51.9,22.96 v55.41,22.96 56.3,22.96 R63.2 59.96,15.67 61.15,14.48 67.82,14.48 69.22,15.88 U$11.S | CH-2.1 62.38,70.02 61.62,69.26 61.62,67.69 62.51,66.8 | 23.2,49.34 21.65,47.78 20.86,47.78
  Bottom 0.305: 75.96,63.08 75.94,63.11
  Bottom 0.406: CPC1002.4 22.05,22.81 | 27.16,26.42 R26.2 | 55.22,77.98 55.16,77.92 55.1,77.98 | 59.93,75.8 R56.2 | D9.C 57.38,64.49 58.38,63.5 v61.72,63.5 | 73.91,48.53 R28.2
  Bottom 0.61: U$8.S 27.83,27.05 R26.2 26.67,26.91 26.67,27.43 28.96,29.72 38.61,29.72 41.17,32.28 41.17,37.46 44.07,40.36 +12V.TP 48.21,42.12 50.55,44.45 50.55,46.07 46.3,50.31 7555.8 44.62,52.09 40.84,55.87 40.84,72.95 39.37,74.42 39.37,76.75 40.6,77.98 55.1,77.98 | 22.05,22.81 25.65,26.42 | 27.16,26.42 25.65,26.42 | 55.22,77.98 59.21,77.98 59.93,77.26 59.93,75.8 68.12,75.8 68.89,75.03 68.89,66.18 69.8,65.27 73.77,65.27 75.94,63.11 77.69,64.86 77.69,68.91 CH-2.1 | REF_POT1.E 63.25,45.21 D2.C 73.91,48.53 | R10.2 53.58,20.57 | 53.58,20.57 R23.2 | 25.65,26.42 24.89,27.18 24.89,39.12 24.61,39.39 22.23,39.39 | R2.A 68.58,29.46 R5.2 | v55.41,22.96 55.41,20.36 55.05,20 54.15,20 53.58,20.57 | R58.2 75.96,63.08 | CHRIN_STS_BRD.P$4 23.77,70.53 28,70.53 U$9.P$3 | SUPPLY.1 86.11,27.97 85,26.86 82.52,26.86 81.64,27.74 U$1.8 | BYPASS-JP.2 21.41,47.17 21.41,40.21 22.23,39.39 | 22.23,39.39 21.52,38.69 C5.1
AMS_ERR  (via drill 0.35)
  Top 0.406: U$5.G 46.07,21.96 46.92,22.81 46.92,25.56 48.79,27.42 49.79,27.42 R24.1 50.22,27.43 50.67,26.98 v50.67,25.17
  Bottom 0.406: CHR_HDP_1.P$6 61.42,6.65 56.3,11.78 56.3,24.46 55.61,25.15 50.7,25.15 v50.67,25.17
AMS_ERR_INV
  Top 0.406: 42.33,19.98 42.27,20.03 U$5.5 | U$5.2 44.39,20.63 U$5.1 43.89,20.33 U$5.D | U$5.D 43.08,19.98 42.33,19.98 | R11.1 49.8,18.85 R13.2 44.97,18.8 U$5.D | AMS.C 42.77,30.99 45.21,30.99 46.74,29.46 46.74,26.42 45.97,25.65 43.43,23.11 U$5.D | U$5.6 42.33,19.98
AMS_LED_NEG
  Top 0.406: CHR_HDSCS.P$8 20.53,6.4 20.56,6.43 23.95,6.43 31.5,13.97 49.28,13.97 51.75,16.44 R13.1
CH_EN
  Bottom 0.406: CHR_HDP_1.P$3 75.44,16.76 90.17,16.76 91.44,18.03 105.66,18.03 106.68,19.05 106.68,28.94 102.56,33.06 102.56,45.44 106.8,49.69 106.8,66.17 100.67,72.3 CHRIN_STS_BRD1.P$2
CH_HV_IL  (via drill 0.35)
  Top 0.406: R29.1 29.96,28.19 v30.73,28.19
  Bottom 0.406: U$8.5 34.84,26.81 U$8.6 34.54,26.11 U$8.D | U$8.D 35.04,25.15 U$8.1 34.84,24.49 U$8.2 34.04,19.8 R12.2 33.29,16.78 33.27,16.76 34.29,15.75 CH-HV-IL.TP 34.97,16.18 38.12,16.18 39.23,15.07 39.23,5.32 40.67,3.87 73.67,3.87 74.33,4.53 CHR_HDP_1.P$10 | v30.73,28.19 34.04,28.19 34.54,27.69 U$8.D
CH_SDC_RESET
  Top 0.406: R19.2 52.27,62.48 53.92,60.83 7555.4
  Bottom 0.406: 7555.4 53.92,60.85 51.7,63.07 44.4,63.07 41.82,65.65 41.82,74.42 JP3.2
CHGR_ERR
  Top 0.406: JP2.1 35.56,42.93 CHGR-ERR.TP 36.83,48.26 36.83,69.78 37.92,70.87 39.77,70.87 CHGR_ERR.A 53.47,57.17 7555.3
CHGR_ERR_O
  Top 0.406: U$3.G 33.91,53.2 R1.1 35.81,51.29 35.81,49.78 33.27,47.24 JP2.2
CHR_LED_POS
  Top 0.406: CHR_HDSCS.P$1 2.54,15.82 2.54,46.41 4.83,48.69 14.33,48.69 16.7,51.07 16.7,66.66 20.19,70.15 CHRIN_STS_BRD.P$3
CON_SRC_IL  (via drill 0.35)
  Top 0.406: CON-SRC-IL.TP 27.18,15.49 28.96,15.49 30.73,17.27 30.73,21.59 29.72,22.61 R27.1 29.53,22.61 34.29,27.36 34.29,30.23 33.88,30.63 v31.07,30.63 | U$4.3 58.55,52.7 49.78,43.94 44.31,43.94 43.18,45.07 2V1.3 43.18,44.67 37.84,39.34 33.24,39.34 JP4.1 | v35.56,12.19 40.39,12.19 41.4,13.21 50.8,13.21 53.09,15.49 v58.67,15.49
  Bottom 0.406: R21.2 28.94,17.26 CON-SRC-IL.TP 32.77,14.99 v35.56,12.19 | CHR_HDP_1.P$8 68.33,7.11 67.31,8.13 64.52,8.13 64.01,8.64 64.01,10.41 75.06,21.46 | v31.07,30.63 28.7,33 JP4.1 | v58.67,15.49 61.47,15.49 68.23,22.26 74.26,22.26 75.06,21.46 | U$1.3 79.1,23.47 78.8,23.77 77.16,23.77 76.85,23.46 76.85,22.29 76.07,21.51 75.1,21.51 75.06,21.46
CON_SRC_IL_BF  (via drill 0.35)
  Top 0.406: v44.67,25.45 44.7,25.48 R16.2 | v39.9,20.14 39.98,20.06 R3.2
  Bottom 0.406: v39.9,20.14 36.6,20.14 36.03,20.71 36.03,24.42 37.06,25.45 v44.67,25.45 44.63,25.49 44.63,31.99 46.21,33.56 56.17,33.56 57.4,32.33 57.4,23.11 58.93,21.59 65.6,21.59 67.93,23.92 67.93,23.98 68.7,24.75 79.54,24.75 80.37,23.92 U$1.2 U$1.1
CON_SRC_IL_IN
  Top 0.406: R9.2 45.72,49.04 2V1.2
D+_TEENSY
  Top 0.406: CHR_HDP_2.P$5 49.78,8.43 49.78,10.41 50.55,11.18 53.59,11.18 54.97,12.55 82.01,12.55 89.66,20.2 89.66,26.16 94.23,30.73 94.23,40.39 96.07,42.22 J2.3
D-_TEENSY
  Top 0.406: J2.2 96.71,41.57 95,39.86 95,30.48 90.42,25.91 90.42,20.07 82.3,11.94 55.37,11.94 53.85,10.41 51.77,10.41 CHR_HDP_2.P$3
D_CAN_H
  Bottom 0.406: CHR_HDP_1.P$5 74.33,11.18 78.39,15.24 90.93,15.24 92.2,16.51 106.43,16.51 108.2,18.29 108.2,30.56 104.89,33.88 104.82,33.88 104.42,34.27 104.42,44.34 108.2,48.12 108.2,76.43 106.03,78.6 101.06,78.6 100.06,77.6 CHRIN_STS_BRD1.P$4
D_CAN_L
  Bottom 0.406: CHR_HDP_1.P$4 71.33,10.92 76.41,16 90.42,16 91.69,17.27 106.17,17.27 107.44,18.54 107.44,29.75 103.64,33.56 103.64,45.09 107.45,48.9 107.45,72.89 105.04,75.3 CHRIN_STS_BRD1.P$3
ERR_RST_BTN  (via drill 0.35)
  Top 0.406: JP1.1 101.09,55.15 100.36,55.88 96.04,55.88 95.25,56.67 R61.2 | 77.72,49.47 78.89,48.31 89.5,48.31 89.92,47.89 IC2.2 | D8.C 64.24,45.47 68.07,45.47 71.07,48.46 76.71,48.46 77.72,49.47 | 77.72,49.47 D7.A | CHR_HDSCS.P$6 11.96,3.79 v12.45,3.3 | v107.7,11.94 107.7,24.24 98.28,33.66 v98.28,37.34
  Bottom 0.406: JP1.1 94.23,46.99 | 94.23,46.99 IC2.2 | v12.45,3.3 13.46,2.29 98.04,2.29 v107.7,11.94 | v98.28,37.34 98.28,42.95 94.23,46.99
ERR_RST_BTN_2
  Bottom 0.406: JP1.3 91.69,49.53 IC2.3
ERR_RST_BTN_DELAY
  Top 0.406: U$4.7 70.48,53.98 71.63,55.12 71.63,58.55 72.52,59.44 79.37,59.44 80.31,58.49 80.31,56.74 81.17,55.88 84.58,55.88 86.3,54.16 86.3,52.89 88.39,50.8 90.93,50.8 91.69,50.04 91.69,45.21 90.93,44.45 IC2.1
ERR_RST_INIT
  Top 0.406: RESET_TEST.1 95,64.52 91.44,60.96 83.57,60.96 IC2.8 IC2.4
ERR_RST_SIDE
  Bottom 0.406: JP1.2 98.55,55.39 98.06,55.88 94.49,55.88 93.98,55.37 93.98,54.1 92.92,53.04 88.63,53.04 84.52,57.15 IC2.9
ERROR_SIG
  Top 0.406: 555.3 12.72,37.34 12.19,36.81 12.19,29.72 12.95,28.96 17.8,28.96 R30.1 20.57,31.73 23.84,31.73 23.87,31.75 32.51,31.75 JP5.2
  Bottom 0.406: 555.3 17.53,41.15 ERROR-SIG.TP
ERROR_SIG_JP  (via drill 0.35)
  Top 0.406: JP5.1 35.05,36.83 36.83,36.83 37.59,36.07 37.59,28.45 32.26,23.11 v32.26,21.59
  Bottom 0.406: R26.1 32.76,24.4 U$8.G 33.02,24.14 33.02,23.86 32.26,23.1 v32.26,21.59
FALLING_EDGE
  Top 0.406: IC2.6 89.92,57.66 94.49,62.23 97.79,62.23 98.81,63.25 RESET_TEST.2
  Bottom 0.406: U$2.1 72.77,53.14 73.33,52.58 77.22,52.58 78.49,53.85 78.49,56.13 80.87,58.52 88.55,58.52 IC2.6
GND  (via drill 0.35)
  Top 0.406: TS_TRIG.C ERROR_SIG.C | U$5.S 41.54,21.96 41.15,22.35 AMS1.C | R60.2 R31.1
  Bottom 0.406: C3.- 21.84,58.93 R25.1 25.42,54.41 C15.2 | C11.2 C13.2 51.06,54.56 49.16,52.66 C1.1 | C2.2 C6.2 11.11,35.49 9.16,33.54 R22.1 9.16,32.5 10.16,31.5 12.95,31.5 555.1 | CPC1002.2 19.05,10.49 CHR_HDSCS.P$4 | U$7.S 42.03,18.99 42.8,18.22 43.55,18.22 v43.55,18.2 | U$1.4 77.83,20.01 78.78,19.06 89.55,19.06 90.93,20.44 C7.-
  pour Top (isolate 0.254): 0.4,10.89 0.4,2.79 2.4,0.79 106.6,0.79 109.1,3.29 109.1,77.69 107.4,79.39 3.3,79.39 0.4,76.49
  pour Bottom (isolate 0.254): 5.2,0.39 7,0.39 103.7,0.39 108.8,5.49 108.8,76.69 105.9,79.59 4.4,79.59 0.9,76.09 0.9,4.69
GND_TEENSY  (via drill 0.35)
  Top 0.406: J2.8 107.55,41.1 J2.10 | J2.10 J2.11 | J2.11 107.39,44.54 J2.9 105.93,44.12 J2.5 105.86,43.52 105.84,43.55 95.19,43.55 92.77,41.13 92.77,31.13 88.09,26.46 88.09,20.75 81.1,13.76 54.24,13.76 53.05,12.57 v52.41,12.57 | J2.7 J2.11 | J2.10 J2.6
  Bottom 0.406: J2.7 J2.6 | CHR_HDP_2.P$2 48.01,11.9 48.66,12.55 v52.41,12.55 v52.41,12.57
GNDX
  Top 0.61: GNDX.2 101.64,18.54 104.9,18.54 106.43,17.02 106.43,8.38 102.11,4.06 80.84,4.06 78.55,1.78 6.1,1.78 1.52,6.35 1.52,57.48 2.53,58.49 7.35,58.49 GNDX1.1 GNDX1.2
  Bottom 0.61: GNDX.2 GNDX.1
HV_RESET
  Top 0.406: R20.1 13.72,41.39 555.4 14.73,39.88 HV-RESET.TP
  Bottom 0.406: CHR_HDSCS.P$5 6.81,6.4 3.3,9.91 3.3,28.7 4.57,29.97 14.22,29.97 17.53,33.27 HV-RESET.TP
ID_TEENSY
  Top 0.406: CHR_HDP_2.P$4 46.48,8.13 46.48,9.91 48.51,11.94 53.34,11.94 54.58,13.18 81.77,13.18 88.9,20.31 88.9,26.29 93.47,30.86 93.47,40.64 95.7,42.87 J2.4
IMD_ERR
  Bottom 0.406: U$7.G 48.64,19.95 R23.1 49.8,17.26 61.72,5.33 70.01,5.33 CHR_HDP_1.P$9
IMD_ERR_INV  (via drill 0.35)
  Top 0.406: IMD.C 48.51,32.51 v49.78,31.24
  Bottom 0.406: U$7.5 42.27,21.88 U$7.6 42.97,21.58 U$7.D 43.93,22.08 U$7.1 44.59,21.88 U$7.2 50.29,21.08 51.58,22.37 R10.1 49.85,24.59 R17.2 49.78,27.5 v49.78,31.24
IMD_GND1
  Bottom 0.406: CHR_HDP_1.P$2 73.2,17.53 89.92,17.53 91.19,18.8 105.41,18.8 105.92,19.3 105.92,27.92 101.66,32.17 101.66,45.56 105.92,49.82 105.92,65.28 102.27,68.92 97.73,68.92 96.78,69.88 96.78,73.16 97.48,73.86 102.57,73.86 103.06,73.36 CHRIN_STS_BRD1.P$1
IMD_LED_NEG  (via drill 0.35)
  Top 0.406: CHR_HDSCS.P$7 16.44,7.87 23.92,7.87 36.66,20.61 v36.66,21.86
  Bottom 0.406: v36.66,21.86 38.35,21.86 40.62,24.13 46.74,24.13 47.75,25.15 47.75,31.18 48.56,31.99 50.85,31.99 51.75,31.09 R17.1
LV_SUPPLY
  Bottom 0.61: LV_SUPPLY_IN.1 31.75,9.31 30.96,8.52 24.83,8.52 24.02,7.71 24.02,5.26 22.82,4.06 4.57,4.06 1.75,6.89 1.75,68.89 3.12,70.26 7.06,70.26 8.04,69.28 CH-1.1
LV_SUPPLY_OUT  (via drill 0.35)
  Top 0.61: FUSE_1.5A.P$1 79.76,16.44 v79.76,14.48
  Bottom 0.406: 31.75,5.08 LV_SUPPLY_IN.2
  Bottom 0.61: 31.75,5.08 33.83,3 84.08,3 85.14,4.06 85.14,10.67 ACC_LV_SUPPLY.1 87.12,13.21 85.85,14.48 v79.76,14.48
N$1
  Top 0.406: 7555.2 49.6,50.31 46.45,50.31 R9.1
  Bottom 0.406: C1.2 53.86,54.63 7555.2
N$3
  Bottom 0.406: C2.1 8.7,39.88 555.5
N$4
  Top 0.406: CHGR_ERR.C 39.22,67.5 41.89,64.82 R18.2
N$7
  Bottom 0.406: C6.1 6.35,37.08 555.6 555.7
N$9
  Bottom 0.406: R21.1 24.7,16.81 CPC1002.1
N$10
  Top 0.406: CON_SRC_IL.A 26.43,21.98 R27.2
N$11
  Top 0.406: R29.2 26.18,27.55 CH_HV_IL.A
N$13
  Top 0.406: R30.2 20.81,26.84 ERROR_SIG.A
N$14
  Top 0.406: TS_TRIG.A 21.23,19.47 R34.2
N$16
  Bottom 0.406: C11.1 48.91,59.71 7555.5
N$18
  Bottom 0.406: C13.1 47.32,56.15 7555.6 7555.7
N$21
  Top 0.406: 88.65,28.96 SUPPLY.2
  Top 0.61: SI4425.3 SI4425.2 SI4425.1 78.93,26.65 86.34,26.65 88.65,28.96
N$23
  Top 0.406: 82.72,18.9 FUSE_1.5A.P$2
  Top 0.61: SI4425.8 SI4425.7 SI4425.6 SI4425.5 82.72,18.9
N$24
  Top 0.406: R44.2 POWER.A
N$26
  Top 0.406: 2V5_REF.A 73.25,35.56 76.47,35.56 R45.2
N$35
  Top 0.406: AMS.A 44.23,35.46 R14.1
N$37
  Top 0.406: IMD.A 48.73,35.24 R15.1
N$38
  Bottom 0.406: C26.1 59.74,48.78 R33.1 69.55,48.78 C4.1 70.93,48.83 72.64,50.55 74.41,50.55 R28.1 75.95,49.01 75.95,45.97 75.18,45.21 D2.A
N$40
  Bottom 0.406: U$2.3 70.23,56.52 69.58,57.17 R32.2
N$41
  Bottom 0.406: U$2.2 71.5,52.7 71.12,52.32 66.29,52.32 64.77,50.8 R33.2
N$42
  Top 0.406: D8.A 68.6,49.28 74.05,49.28 74.91,50.14 R39.2
N$43
  Top 0.406: D7.C 75.66,54.37 R46.2
N$44
  Top 0.406: U$4.6 71.26,52.7 R39.1 R46.1 72.91,55.83 C16.1
N$45
  Bottom 0.406: U$2.6 70.23,59.86 69.3,58.93 67.06,58.93 65.02,60.96 61.98,60.96 60.18,59.17 R47.1
N$46
  Bottom 0.406: R54.1 C17.1 65.04,71.32 R48.1 61.24,66.55 D9.A
N$47
  Bottom 0.406: R48.2 68.96,64.63 U$2.5
N$48
  Bottom 0.406: R56.1 R54.2
N$49
  Bottom 0.406: U$2.8 72.77,59.82 73.76,58.82 77.11,58.82 77.96,59.67 R58.1
N$50
  Top 0.406: R57.1 65.26,56.15 66.29,55.12 68.78,55.12 U$4.8
N$51
  Top 0.406: R59.1 IC2.14
N$56
  Top 0.406: R16.1 44.67,29.11 AMS1.A
RISING_EDGE
  Top 0.406: IC2.5 93.73,58.42 93.73,60.45 94.74,61.47 99.82,61.47 101.35,62.99 RESET_TEST.3
  Bottom 0.406: U$2.7 71.5,58.74 72.66,57.58 78.66,57.58 79.5,58.42 79.5,61.47 80.46,62.43 91.24,62.43 92.71,60.96 92.71,55.37 91.95,54.61 IC2.5
SDC_COMP_POS
  Top 0.406: CHR_HDSCS.P$3 14.96,11.59 16.57,13.2 27.91,13.2 33.8,19.08 33.8,22.36 34.35,22.91 37.68,22.91 38.13,22.47 38.13,17 38.74,16.39 R3.1
SDC_KILL
  Top 0.406: 2V1.1 48.26,47.37 50.16,49.28 53.85,49.28 57.91,53.34 57.91,54.61 58.55,55.25 U$4.1
SHUTDOWN_FL
  Top 0.61: SDC-1.1 93.94,4.83 80.47,4.83 78.19,2.54 11.68,2.54 10.41,3.81 10.41,17.82 SDC-2.2
  Bottom 0.61: SDC-1.2 SDC-1.1
SHUTDOWN_INTERLOCK_IN  (via drill 0.35)
  Top 0.61: v15.29,62.87 15.29,75.48 17.28,77.47 49.22,77.47 49.95,76.73 SDC-3.1
  Bottom 0.61: SDC-2.1 15.24,24.17 15.24,29.46 20.07,34.29 20.07,44.45 18.03,46.48 18.03,56.9 15.29,59.64 v15.29,62.87
SP_RESET
  Top 0.406: R62.1 61.98,24.13 | 61.98,24.13 66.29,24.13 U$11.D | U$11.2 66.86,22.3 U$11.1 67.28,23.1 67.78,22.6 U$11.D | U$11.5 68.78,22.3 U$11.6 68.32,23.1 U$11.D | SP_RESET.TP 67.82,18.8 U$11.D | SP_RESET2.TP 55.88,39.62 55.88,29.21 58.67,26.42 60.71,26.42 61.98,25.15 61.98,24.13
  Bottom 0.406: SP_RESET.TP 60.45,11.43 60.45,8.64 60.96,8.13 63.25,8.13 64.72,6.65 CHR_HDP_1.P$7 | SP_RESET2.TP 53.85,41.7 55.88,43.74 55.88,62.37 50.8,67.45 48.89,67.45 47.54,68.79 47.54,74.42 46.44,75.52 JP3.1
SP_RESET_INV  (via drill 0.35)
  Top 0.406: R63.1 64.75,19.3 U$11.G 66.15,20.97 v64.01,23.11
  Bottom 0.406: IC2.10 80.56,54.61 77.47,51.52 77.47,44.2 76.96,43.69 72.9,43.69 71.63,42.42 71.63,36.07 70.87,35.31 64.7,35.31 63.5,34.11 63.5,23.61 63.99,23.11 v64.01,23.11
TO_GREEN_TSAL
  Top 0.406: CHR_HDSCS.P$2 13.46,7.9 13.46,5.33 15.24,3.56 55.88,3.56 57.4,5.08 57.4,7.11 59.94,9.65 CHR_HDP_1.P$1
TO_RELAY
  Top 0.406: U$3.5 27.23,51.87 U$3.6 27.69,51.07 U$3.D | U$3.D 28.69,52.07 U$3.2 29.15,51.87 U$3.1 | U$3.D 28.19,53.87 U$9.P$1
  Bottom 0.406: D3.C 34.95,57.02 U$9.P$1 29.44,58.93 R25.2 27.42,54.41 C15.1
TO_SHUTDOWN
  Top 0.406: R49.2 | R49.2 18.29,56.4 C3.+ 18.29,61.47 20.07,63.25 24.75,63.25 31.34,69.84 U$9.P$4 31.34,74.92 | BYPASS-JP.1 19.57,51.55 R49.2
  Top 0.61: SDC-3.2 49.95,71.86 49.03,72.78 33.49,72.78 31.34,74.92
  Bottom 0.406: BYPASS-JP.1 20.83,57.4 C3.+
TS_TRIG
  Top 0.406: R34.1 17.11,19.05 TS-TRIG.TP
  Bottom 0.406: TS-TRIG.TP 15.58,19.34 CPC1002.3 19.05,23.88 20.32,25.15 22.35,25.15 23.62,26.42 JP4.3
TS_TRIG1
  Top 0.406: JP4.2 26.16,32.8 25.72,32.36 16.16,32.36 555.2
  Bottom 0.406: R22.2 12.68,34.8 555.2
VBUS_TEENSY
  Top 0.406: CHR_HDP_2.P$6 55.53,11.18 82.8,11.18 91.19,19.56 91.19,25.76 95.76,30.34 95.76,39.37 97.31,40.92 J2.1
VREF-2V5  (via drill 0.35)
  Top 0.406: R45.1 75.44,38.59 | 75.44,38.59 2V5.2 | v68.05,37.55 74.4,37.55 75.44,38.59
  Bottom 0.406: R32.1 62.43,59.17 60.43,57.17 R47.2 58.67,53.59 57.78,52.7 57.78,38.54 58.79,37.53 68.03,37.53 v68.05,37.55
VREF-2V5-BF
  Bottom 0.406: 2V5.1 72.9,41.66 74.17,42.93 79.76,42.93 80.81,41.88 80.81,33.78 79.14,32.12 79.14,29.41 | U$1.7 79.14,29.41 | 79.14,29.41 U$1.6
VREF-2V5-IN
  Bottom 0.406: 2V5.3 77.98,38.1 77.47,37.59 74.95,37.59 R6.2 71.39,33.53 R5.1 74.91,27.04 75.36,26.6 77.37,26.6 77.84,27.06 U$1.5
VREF_8.5V
  Top 0.406: R2.S 57.91,37.59 57.91,48.77 59.18,50.04 63.25,50.04 63.75,50.55 63.75,53.28 63.06,53.98 U$4.2

### Text on the board
tPlace: CHGR_ERR | REALY_BLOCK | 100k | 10k | ERROR_RESET_BLOCK | 0E | 22uF | 10k | 1k | 1uF | 18K | 10k | 1k | 1k | 1k | CHAR_ERR_BLOCK | 33K | 0E | 10k | POWER_BLOCK | 2k | 10k | 10k | HV_RESET_BLOCK | 10k | 10k | 10k | 10k | 10k | 1k | 10k | 10k | 100k | 10k | LED_BLOCK | 100E
bPlace: 220K | 10uF | 1M | 0E | 0.01uF | 10K | 0E | 0E | 0E | 0.1uF | 10uF | 1uF | 0E | 1M | 1uF | DESIGNED BY- / RUCHI / VISHNU | 100nF | 100nF | 10K | HV_RESET_BLOCK | 10nF | 2K9 | 10K | 1K | 10K | 5K | 10K | 10K
tNames: CHARGER BOARD | D_CAN_H | D_CAN_L | GND | SHUTDOWN_INTERLOCK_IN | SP_RESET | CH_SDC_RESET | CH_EN | IMD_GND1 | TO_SHUTDOWN | 12V | chr_led_pos | 12V | RISING_EDGE | LV_Supply | 100uF | GND | FALLING_EDGE | ERR_RST_INIT | TO_SHUTDOWN | ERR_RST_SIDE | ERR_RST_BTN | ERR_RST_BTN_2 | SDC_KILL | 12V | GND | GND | CON_SRC_IL_IN | CON_SRC_IL | CHGR_ERR_O | CHGR_ERR | 6V_REF | VREF_2V5-BF | VREF_2V5 | VREF_2V5-IN | TS_TRIG | TS_TRIG1 | CON_SRC_IL | ERROR_SIG_UP | ERROR_SIG | 12V | SDC_COMPLETE | SHUTDOWN_INTERLOCK_IN | SHUTDOWN_FL | LV_SUPPLY | GND_TEENSY | CHR_LED_POS | TO_GREEN_TSAL | GND | CH_EN | D_CAN_L | TO_GREEN_TSAL | SDC_COMP_POS | GND | D-_TEENSY | D_CAN_H | LV_SUPPLY_OUT | SHUTDOWN_FL | LV_SUPPLY_OUT | CON_SRC_IL | D+_TEENSY | ID_TEENSY | AMS_ERR | IMD_ERR | CH_HV_IL | HV_RESET | ERR_RST_BTN | AMS_LED_NEG | IMD_LED_NEG | VBUS_TEENSY | SP_RESET
tValues: 10K